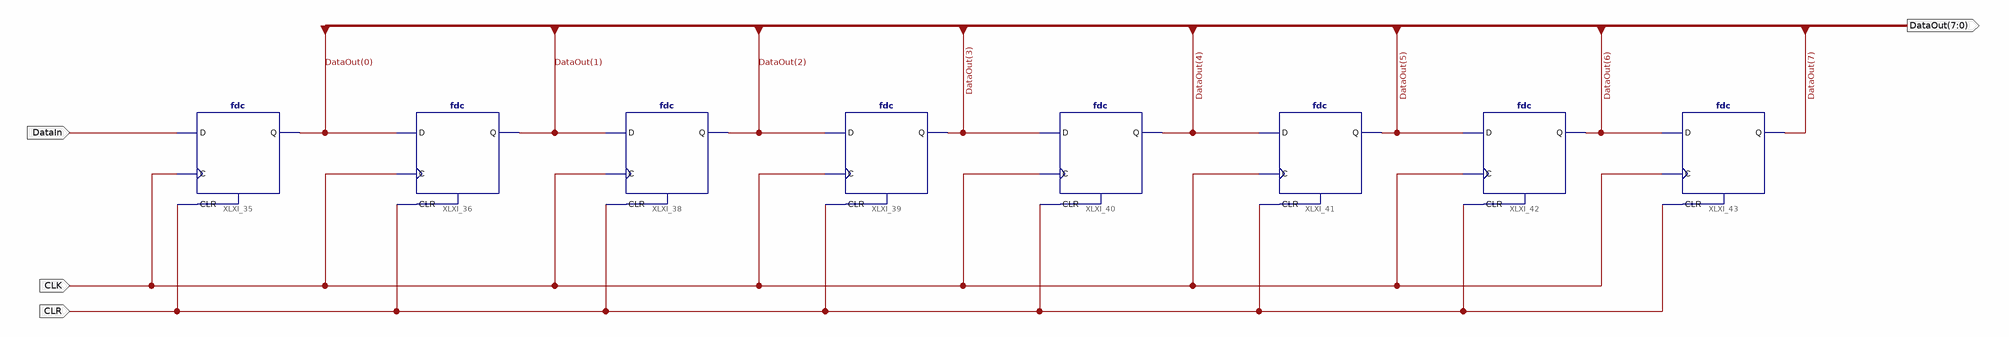
[diagram p0: schematic sheet 1]
// Xilinx ISE schematic RegSIPO_8.sch (spartan6) as structural Verilog: 8 symbols, 4 ports
module RegSIPO_8 (
  input  CLK,
  input  DataIn,
  input  CLR,
  output [7:0] DataOut
);

  fdc XLXI_35 (.C(CLK), .CLR(CLR), .D(DataIn), .Q(DataOut[0]));
  fdc XLXI_36 (.C(CLK), .CLR(CLR), .D(DataOut[0]), .Q(DataOut[1]));
  fdc XLXI_38 (.C(CLK), .CLR(CLR), .D(DataOut[1]), .Q(DataOut[2]));
  fdc XLXI_39 (.C(CLK), .CLR(CLR), .D(DataOut[2]), .Q(DataOut[3]));
  fdc XLXI_40 (.C(CLK), .CLR(CLR), .D(DataOut[3]), .Q(DataOut[4]));
  fdc XLXI_41 (.C(CLK), .CLR(CLR), .D(DataOut[4]), .Q(DataOut[5]));
  fdc XLXI_42 (.C(CLK), .CLR(CLR), .D(DataOut[5]), .Q(DataOut[6]));
  fdc XLXI_43 (.C(CLK), .CLR(CLR), .D(DataOut[6]), .Q(DataOut[7]));
endmodule
